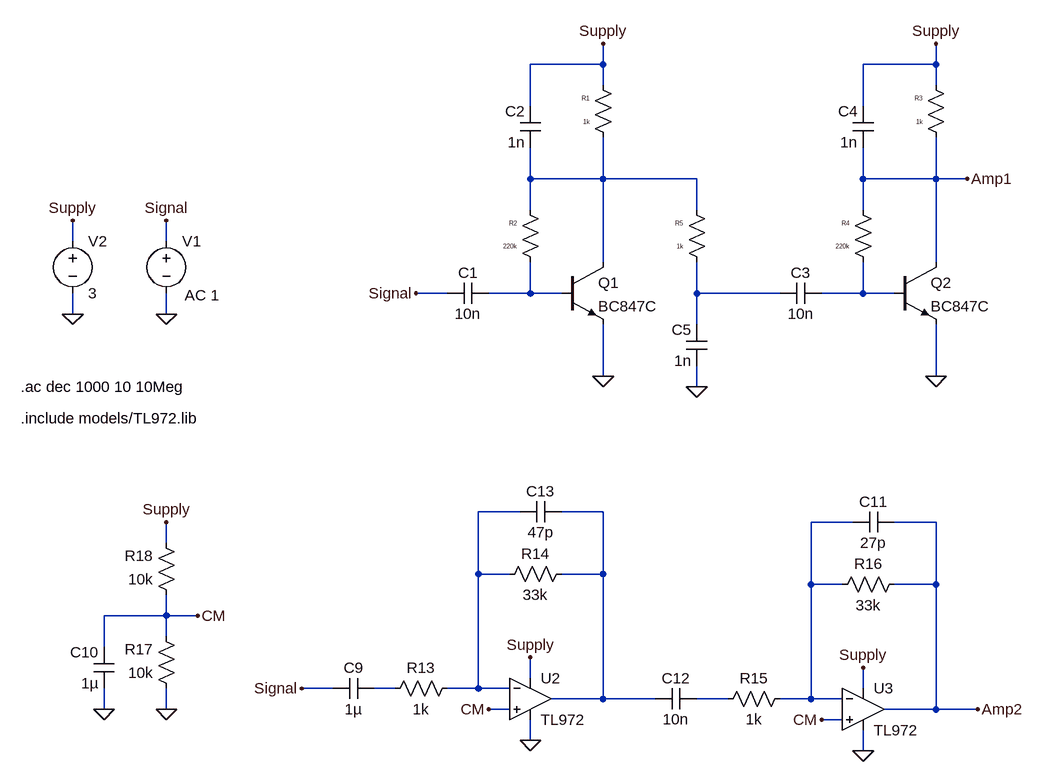
[diagram p0: schematic freq-response_dual-stage.asc]
freq-response_dual-stage.asc, the LTspice schematic file:
Version 4
SHEET 1 2432 1680
WIRE 560 144 560 112
WIRE 560 144 448 144
WIRE 1072 144 1072 112
WIRE 1072 144 960 144
WIRE 560 176 560 144
WIRE 1072 176 1072 144
WIRE 448 208 448 144
WIRE 960 208 960 144
WIRE 448 320 448 272
WIRE 560 320 560 256
WIRE 560 320 448 320
WIRE 704 320 560 320
WIRE 960 320 960 272
WIRE 1072 320 1072 256
WIRE 1072 320 960 320
WIRE 1120 320 1072 320
WIRE 448 368 448 320
WIRE 704 368 704 320
WIRE 960 368 960 320
WIRE -256 416 -256 384
WIRE -112 416 -112 384
WIRE 560 448 560 320
WIRE 1072 448 1072 320
WIRE 320 496 272 496
WIRE 448 496 448 448
WIRE 448 496 384 496
WIRE 496 496 448 496
WIRE 704 496 704 448
WIRE 832 496 704 496
WIRE 960 496 960 448
WIRE 960 496 896 496
WIRE 1008 496 960 496
WIRE -256 528 -256 496
WIRE -112 528 -112 496
WIRE 704 544 704 496
WIRE 560 624 560 544
WIRE 1072 624 1072 544
WIRE 704 640 704 608
WIRE 432 832 368 832
WIRE 560 832 496 832
WIRE 944 848 880 848
WIRE 1072 848 1008 848
WIRE -112 880 -112 848
WIRE 368 928 368 832
WIRE 416 928 368 928
WIRE 560 928 560 832
WIRE 560 928 496 928
WIRE 880 944 880 848
WIRE 928 944 880 944
WIRE 1072 944 1072 848
WIRE 1072 944 1008 944
WIRE -112 992 -112 960
WIRE -112 992 -208 992
WIRE -64 992 -112 992
WIRE -112 1024 -112 992
WIRE -208 1040 -208 992
WIRE 448 1088 448 1056
WIRE 144 1104 96 1104
WIRE 240 1104 208 1104
WIRE 368 1104 368 928
WIRE 368 1104 320 1104
WIRE 416 1104 368 1104
WIRE 960 1104 960 1072
WIRE 560 1120 560 928
WIRE 560 1120 480 1120
WIRE 640 1120 560 1120
WIRE 752 1120 704 1120
WIRE 880 1120 880 944
WIRE 880 1120 832 1120
WIRE 928 1120 880 1120
WIRE -208 1136 -208 1104
WIRE -112 1136 -112 1104
WIRE 416 1136 384 1136
WIRE 1072 1136 1072 944
WIRE 1072 1136 992 1136
WIRE 1136 1136 1072 1136
WIRE 928 1152 896 1152
WIRE 448 1184 448 1152
WIRE 960 1200 960 1168
FLAG 560 624 0
FLAG 560 112 Supply
FLAG -112 528 0
FLAG -112 384 Signal
FLAG -256 384 Supply
FLAG -256 528 0
FLAG 272 496 Signal
FLAG -112 1136 0
FLAG -64 992 CM
FLAG -112 848 Supply
FLAG -208 1136 0
FLAG 448 1184 0
FLAG 448 1056 Supply
FLAG 384 1136 CM
FLAG 1136 1136 Amp2
FLAG 960 1200 0
FLAG 960 1072 Supply
FLAG 896 1152 CM
FLAG 96 1104 Signal
FLAG 1072 624 0
FLAG 1072 112 Supply
FLAG 1120 320 Amp1
FLAG 704 640 0
SYMBOL res 576 272 R180
WINDOW 0 36 76 Left 0
WINDOW 3 36 40 Left 0
SYMATTR InstName R1
SYMATTR Value 1k
SYMBOL cap 384 480 R90
WINDOW 0 0 32 VBottom 2
WINDOW 3 32 32 VTop 2
SYMATTR InstName C1
SYMATTR Value 10n
SYMBOL npn 496 448 R0
SYMATTR InstName Q1
SYMATTR Value BC847C
SYMBOL res 464 464 R180
WINDOW 0 36 76 Left 0
WINDOW 3 36 40 Left 0
SYMATTR InstName R2
SYMATTR Value 220k
SYMBOL cap 464 272 R180
WINDOW 0 24 56 Left 2
WINDOW 3 24 8 Left 2
SYMATTR InstName C2
SYMATTR Value 1n
SYMBOL voltage -112 400 R0
WINDOW 123 28 99 Left 2
SYMATTR Value2 AC 1
SYMATTR InstName V1
SYMATTR Value ""
SYMBOL voltage -256 400 R0
SYMATTR InstName V2
SYMATTR Value 3
SYMBOL res -96 1120 R180
WINDOW 0 36 76 Left 2
WINDOW 3 36 40 Left 2
SYMATTR InstName R17
SYMATTR Value 10k
SYMBOL res -96 976 R180
WINDOW 0 36 76 Left 2
WINDOW 3 36 40 Left 2
SYMATTR InstName R18
SYMATTR Value 10k
SYMBOL cap -192 1104 R180
WINDOW 0 24 56 Left 2
WINDOW 3 24 8 Left 2
SYMATTR InstName C10
SYMATTR Value 1µ
SYMBOL res 336 1088 R90
WINDOW 0 0 56 VBottom 2
WINDOW 3 32 56 VTop 2
SYMATTR InstName R13
SYMATTR Value 1k
SYMBOL cap 208 1088 R90
WINDOW 0 0 32 VBottom 2
WINDOW 3 32 32 VTop 2
SYMATTR InstName C9
SYMATTR Value 1µ
SYMBOL res 512 912 R90
WINDOW 0 0 56 VBottom 2
WINDOW 3 32 56 VTop 2
SYMATTR InstName R14
SYMATTR Value 33k
SYMBOL res 848 1104 R90
WINDOW 0 0 56 VBottom 2
WINDOW 3 32 56 VTop 2
SYMATTR InstName R15
SYMATTR Value 1k
SYMBOL res 1024 928 R90
WINDOW 0 0 56 VBottom 2
WINDOW 3 32 56 VTop 2
SYMATTR InstName R16
SYMATTR Value 33k
SYMBOL cap 1008 832 R90
WINDOW 0 0 32 VBottom 2
WINDOW 3 32 32 VTop 2
SYMATTR InstName C11
SYMATTR Value 27p
SYMBOL cap 640 1136 R270
WINDOW 0 32 32 VTop 2
WINDOW 3 0 32 VBottom 2
SYMATTR InstName C12
SYMATTR Value 10n
SYMBOL Opamps/opamp2 448 1056 R0
SYMATTR InstName U2
SYMATTR Value TL972
SYMBOL Opamps/opamp2 960 1072 R0
SYMATTR InstName U3
SYMATTR Value TL972
SYMBOL cap 496 816 R90
WINDOW 0 0 32 VBottom 2
WINDOW 3 32 32 VTop 2
SYMATTR InstName C13
SYMATTR Value 47p
SYMBOL res 1088 272 R180
WINDOW 0 36 76 Left 0
WINDOW 3 36 40 Left 0
SYMATTR InstName R3
SYMATTR Value 1k
SYMBOL cap 896 480 R90
WINDOW 0 0 32 VBottom 2
WINDOW 3 32 32 VTop 2
SYMATTR InstName C3
SYMATTR Value 10n
SYMBOL npn 1008 448 R0
SYMATTR InstName Q2
SYMATTR Value BC847C
SYMBOL res 976 464 R180
WINDOW 0 36 76 Left 0
WINDOW 3 36 40 Left 0
SYMATTR InstName R4
SYMATTR Value 220k
SYMBOL cap 976 272 R180
WINDOW 0 24 56 Left 2
WINDOW 3 24 8 Left 2
SYMATTR InstName C4
SYMATTR Value 1n
SYMBOL res 720 464 R180
WINDOW 0 36 76 Left 0
WINDOW 3 36 40 Left 0
SYMATTR InstName R5
SYMATTR Value 1k
SYMBOL cap 720 608 R180
WINDOW 0 24 56 Left 2
WINDOW 3 24 8 Left 2
SYMATTR InstName C5
SYMATTR Value 1n
TEXT -336 640 Left 2 !.ac dec 1000 10 10Meg
TEXT -336 688 Left 2 !.include models/TL972.lib

The netlist it stands for:
* freq-response_dual-stage.asc
R1 N001 Supply 1k
C1 N002 Signal 10n
Q1 N001 N002 0 0 BC847C
R2 N002 N001 220k
C2 N001 Supply 1n
V1 Signal 0 AC 1
V2 Supply 0 3
R17 0 CM 10k
R18 CM Supply 10k
C10 0 CM 1µ
R13 N005 N008 1k
C9 N008 Signal 1µ
R14 N006 N005 33k
R15 N007 N009 1k
R16 Amp2 N007 33k
C11 Amp2 N007 27p
C12 N006 N009 10n
XU2 CM N005 Supply 0 N006 TL972  ; pins In+ In- V+ V- OUT
XU3 CM N007 Supply 0 Amp2 TL972  ; pins In+ In- V+ V- OUT
C13 N006 N005 47p
R3 Amp1 Supply 1k
C3 N004 N003 10n
Q2 Amp1 N004 0 0 BC847C
R4 N004 Amp1 220k
C4 Amp1 Supply 1n
R5 N003 N001 1k
C5 0 N003 1n
.model NPN NPN
.model PNP PNP
.lib standard.bjt
.ac dec 1000 10 10Meg
.include models/TL972.lib
.backanno
.end